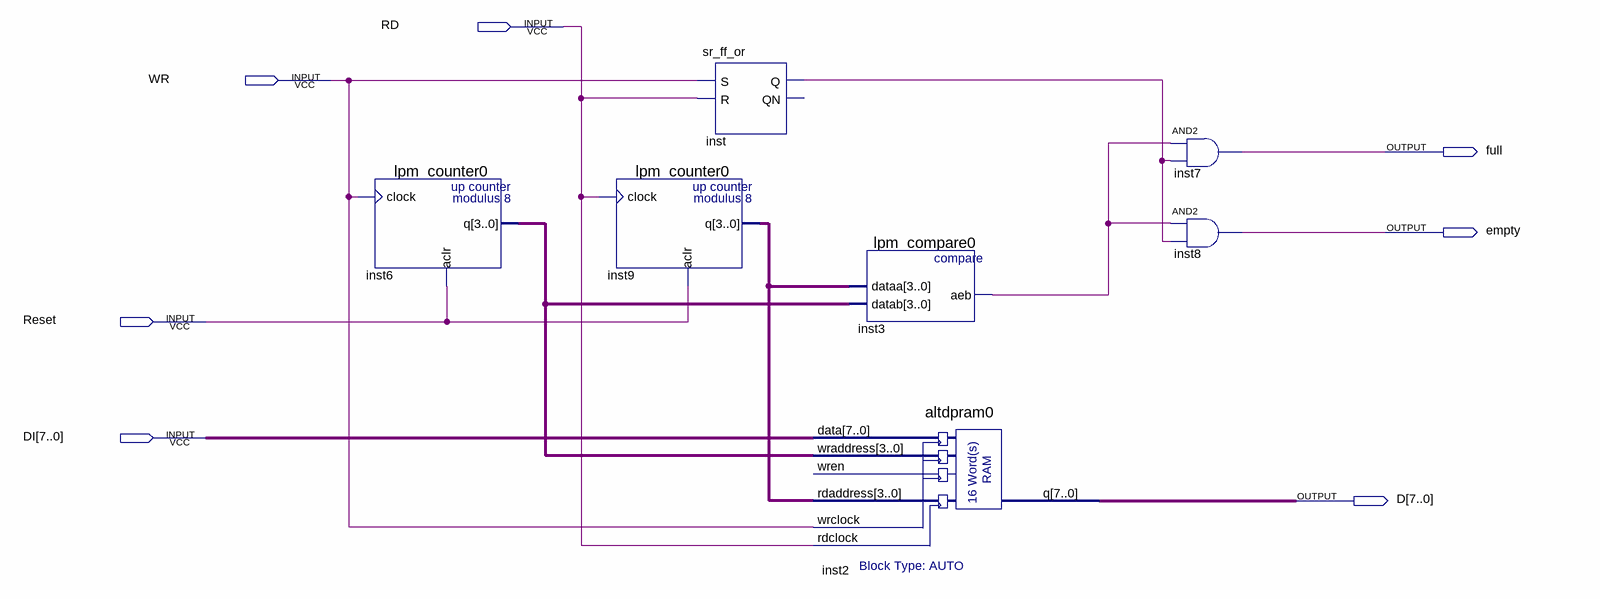
[diagram p0: schematic sheet]
// Quartus schematic fifo3.bdf as structural Verilog: 7 symbols, 7 pins
module fifo3 (
  input  RD,
  input  WR,
  input  Reset,
  input  [7:0] DI,
  output full,
  output empty,
  output [7:0] D
);

  wire inst3_aeb, inst_q;
  wire [3:0] inst6_q, inst9_q;

  lpm_counter0 inst6 (.clock(WR), .aclr(Reset), .q(inst6_q));
  lpm_counter0 inst9 (.clock(RD), .aclr(Reset), .q(inst9_q));
  sr_ff_or inst (.S(WR), .R(RD), .Q(inst_q));  // open: QN
  lpm_compare0 inst3 (.dataa(inst9_q), .datab(inst6_q), .aeb(inst3_aeb));
  altdpram0 inst2 (
    .data(DI), .wraddress(inst6_q), .rdaddress(inst9_q), .wrclock(WR), .rdclock(RD), .q(D));  // open: wren
  and inst7 (full, inst3_aeb, inst_q);
  and inst8 (empty, inst3_aeb, inst_q);
endmodule
